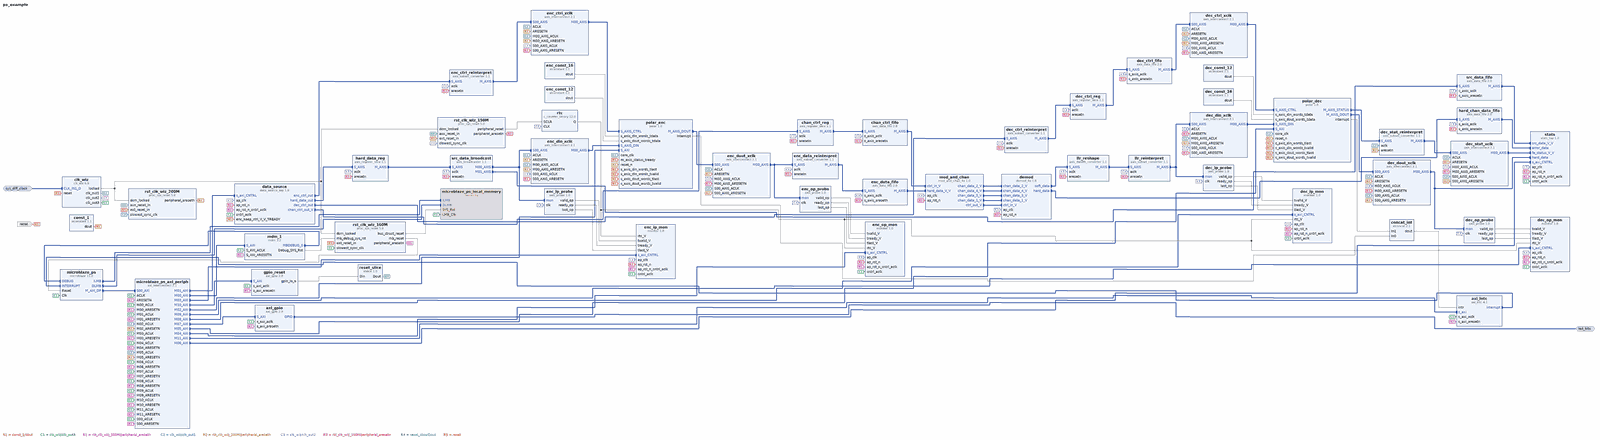
[diagram p0: block diagram of the top level, whole]
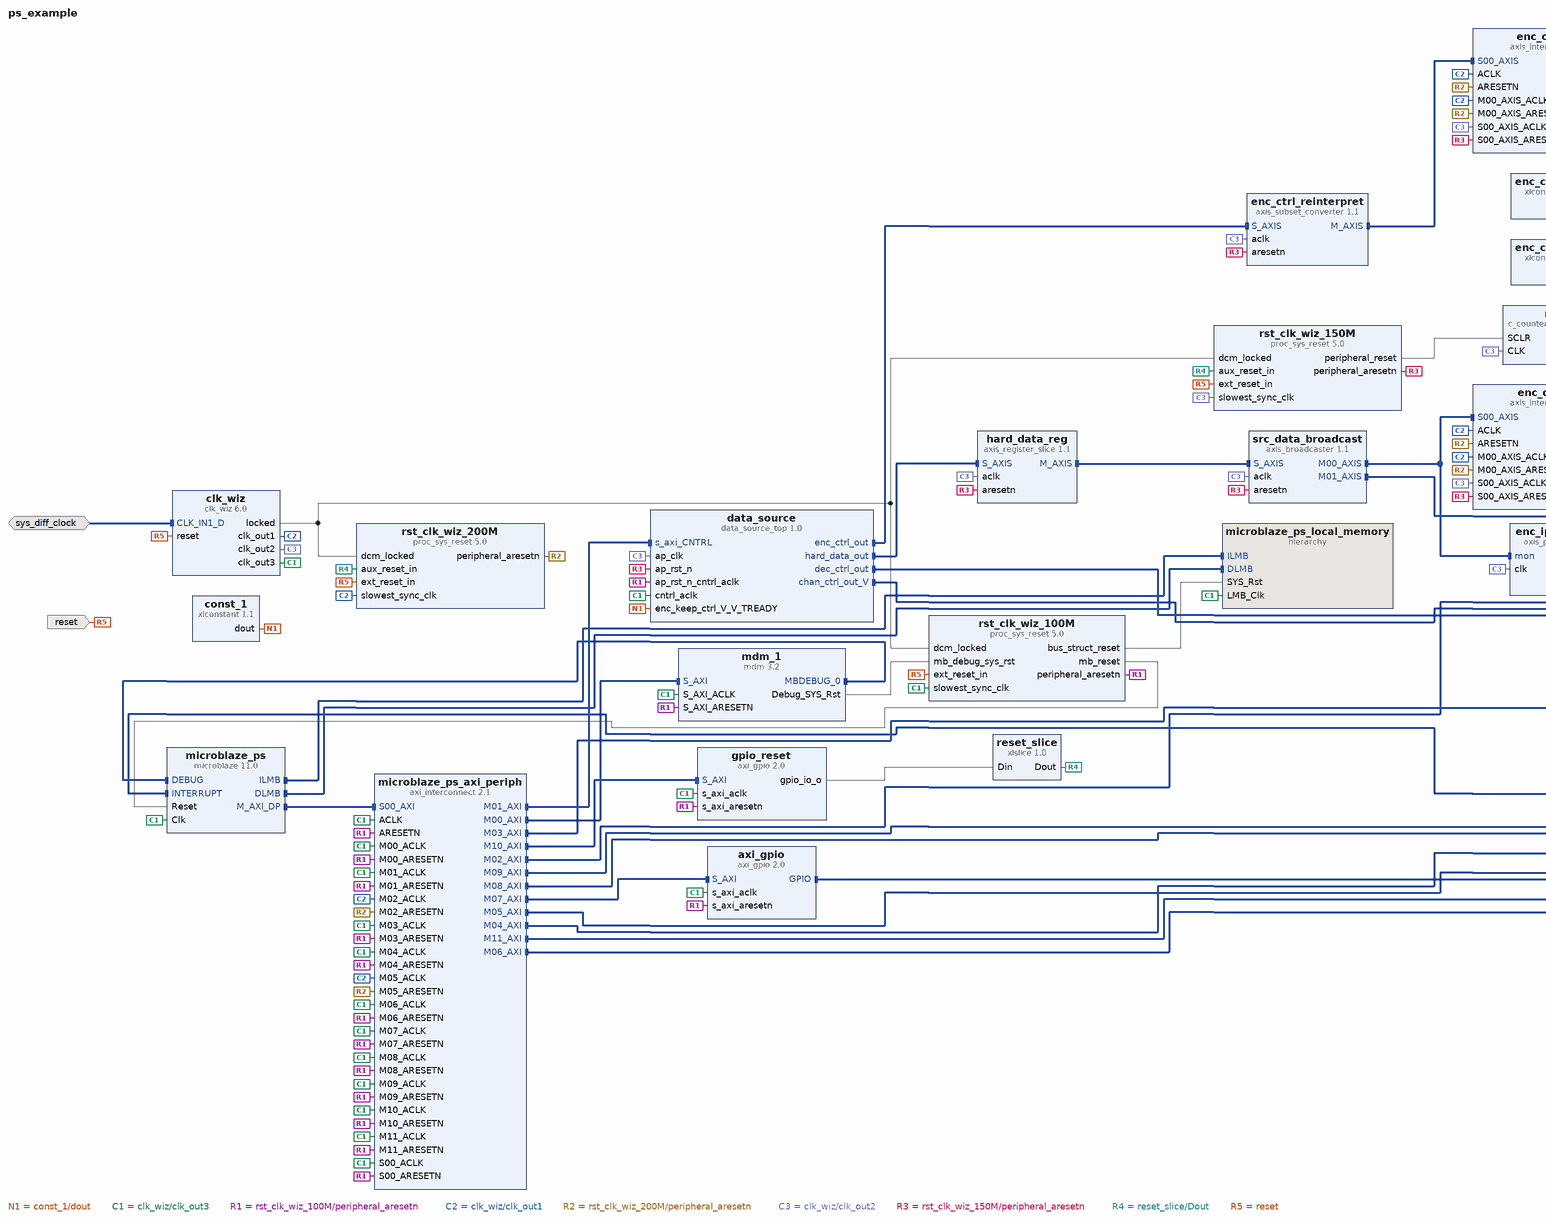
[diagram p1: block diagram of the top level, left part]
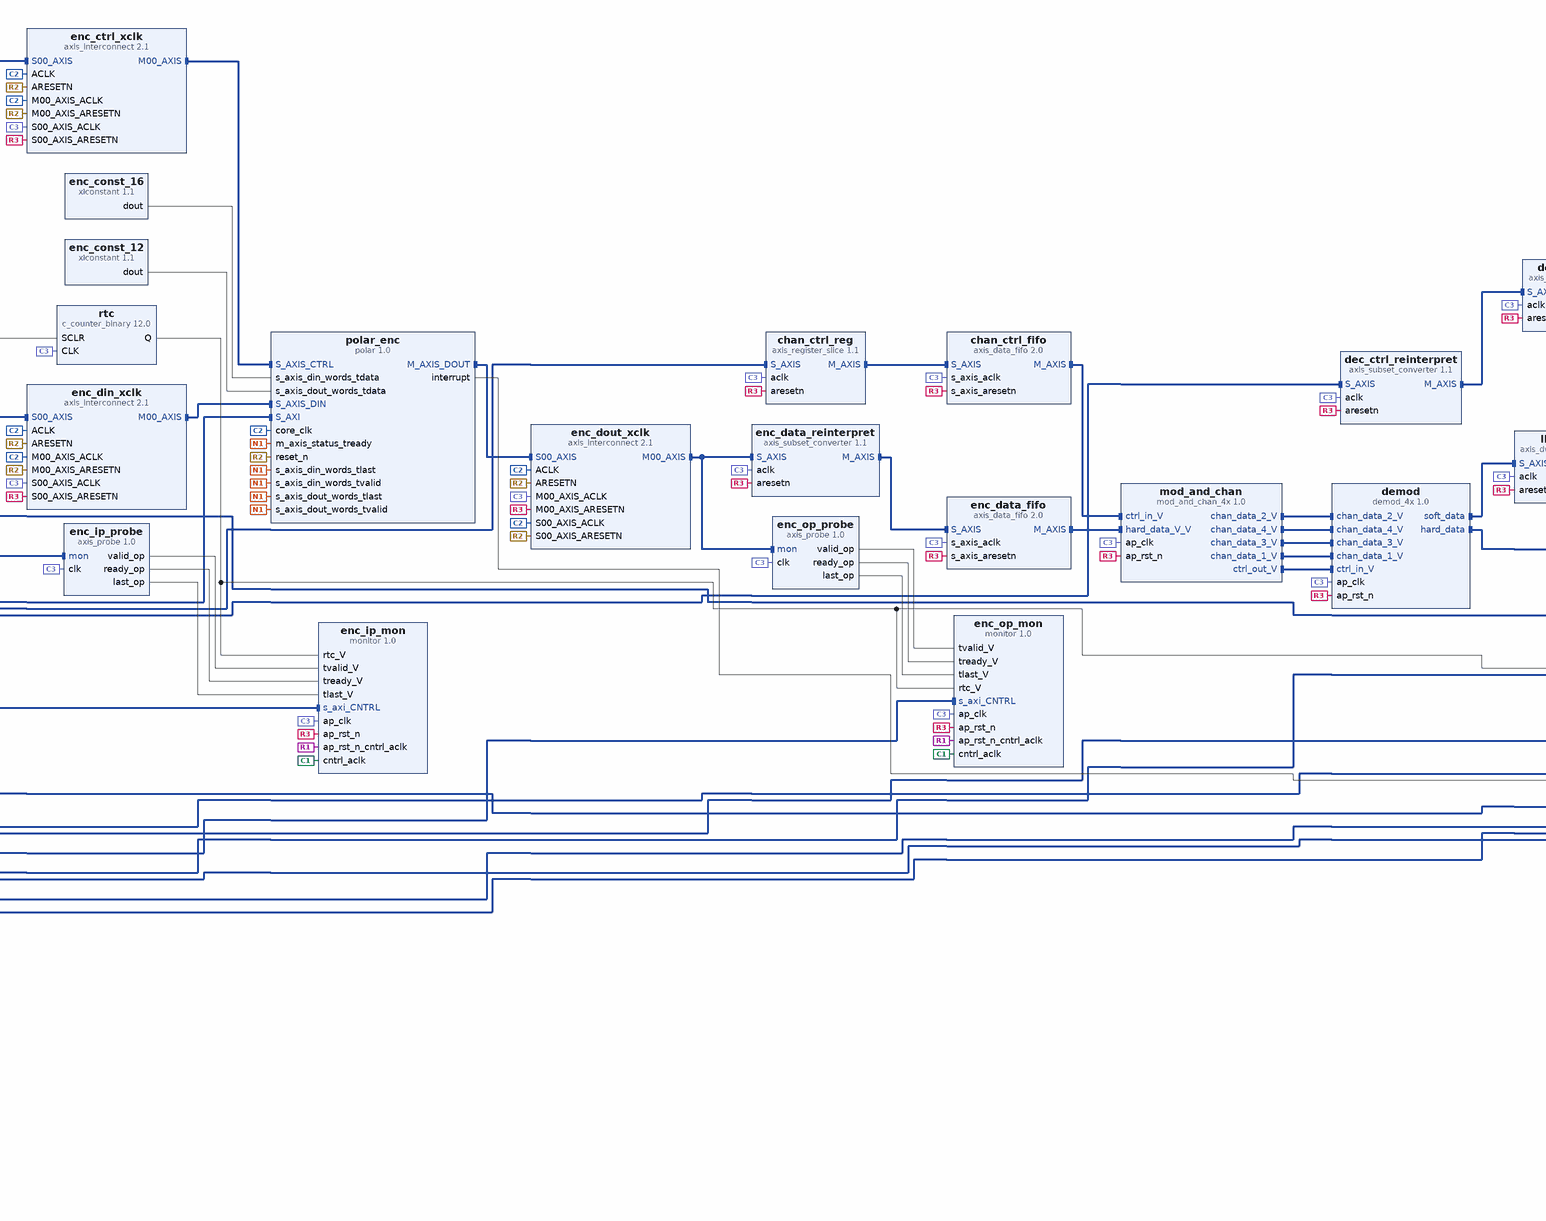
[diagram p2: block diagram of the top level, centre part]
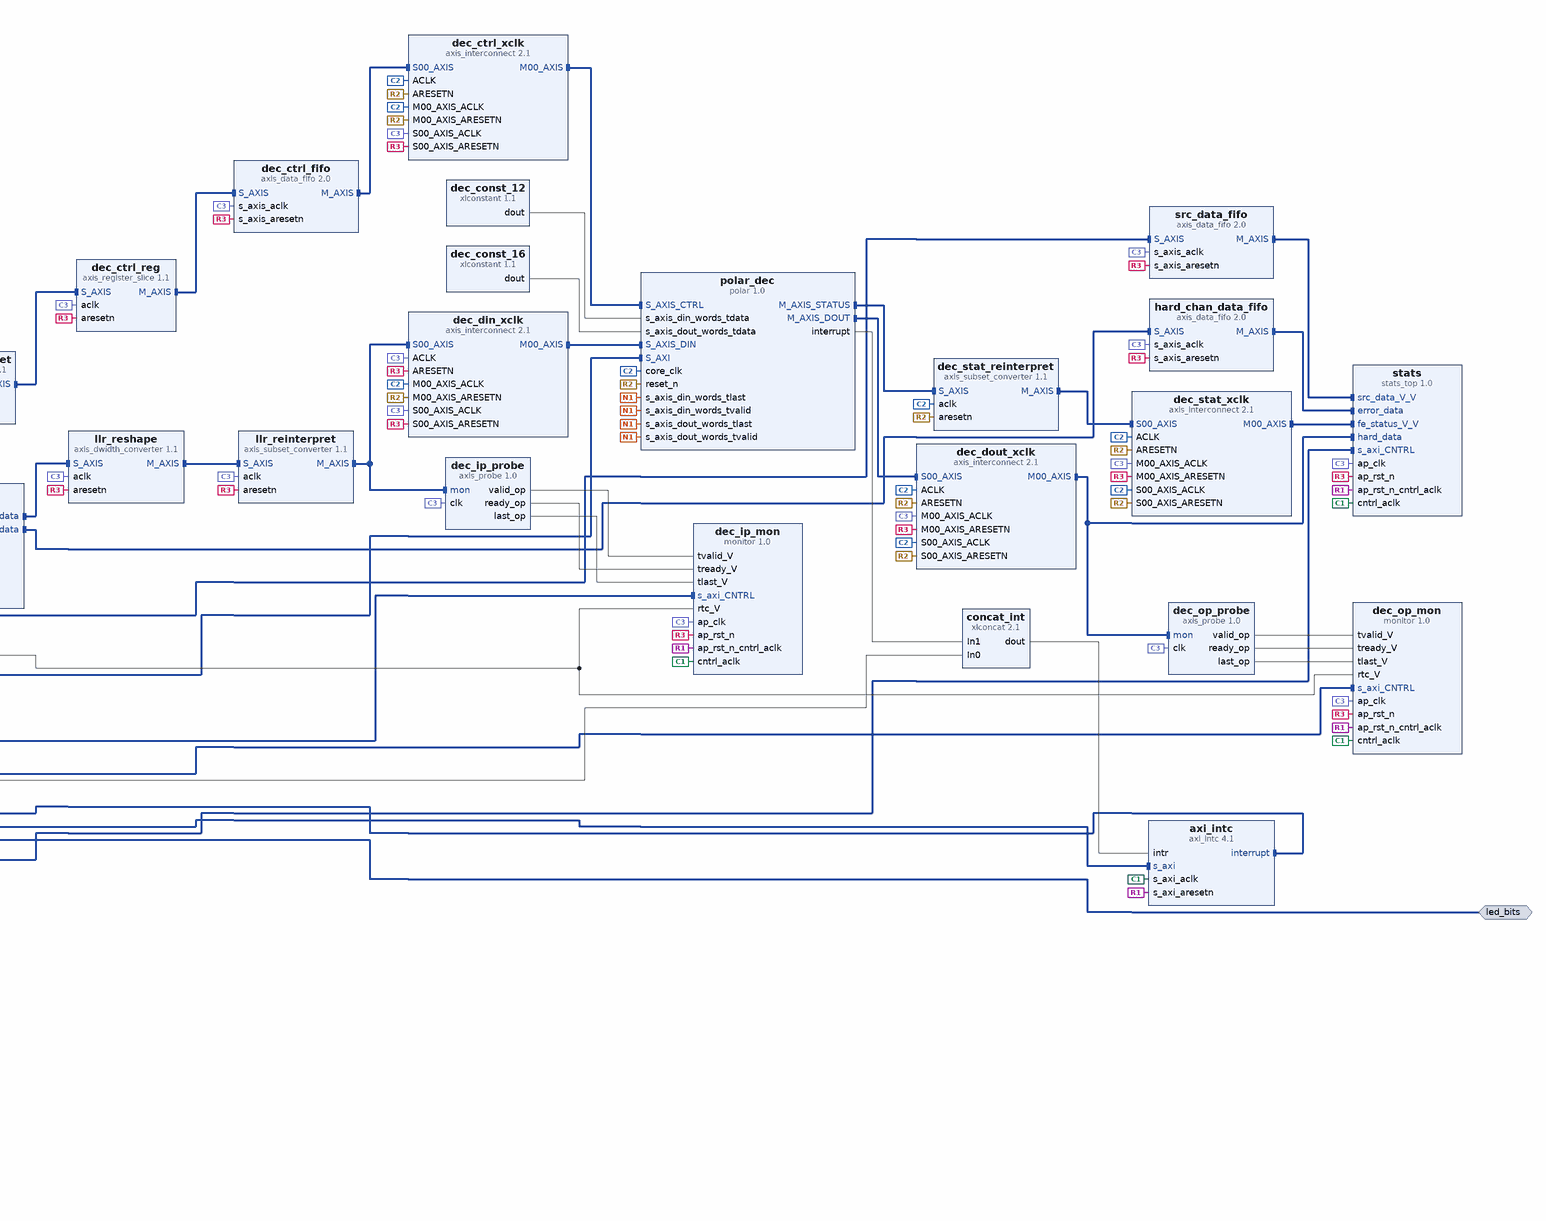
[diagram p3: block diagram of the top level, right part]
# Vivado block design ps_example, xczu9eg-ffvb1156-2-e, Vivado 2018.3
create_bd_design ps_example

create_bd_intf_port -mode Slave -vlnv xilinx.com:interface:diff_clock_rtl:1.0 sys_diff_clock
set_property -dict {CONFIG.FREQ_HZ 100000000} [get_bd_intf_ports sys_diff_clock]
create_bd_intf_port -mode Master -vlnv xilinx.com:interface:gpio_rtl:1.0 led_bits
create_bd_port -dir I -type rst reset
set_property -dict {CONFIG.POLARITY ACTIVE_HIGH} [get_bd_ports reset]

create_bd_cell -type ip -vlnv xilinx.com:ip:clk_wiz:6.0 clk_wiz
set_property -dict [list \
  CONFIG.CLKOUT1_REQUESTED_OUT_FREQ 200 \
  CONFIG.CLKOUT2_REQUESTED_OUT_FREQ 150 \
  CONFIG.CLKOUT2_USED true \
  CONFIG.CLKOUT3_REQUESTED_OUT_FREQ 100 \
  CONFIG.CLKOUT3_USED true \
  CONFIG.PRIM_SOURCE Differential_clock_capable_pin \
] [get_bd_cells clk_wiz]
create_bd_cell -type ip -vlnv xilinx.com:ip:xlconstant:1.1 const_1
set_property -dict {CONFIG.CONST_VAL 1} [get_bd_cells const_1]
create_bd_cell -type ip -vlnv xilinx.com:hls:data_source_top:1.0 data_source
create_bd_cell -type ip -vlnv xilinx.com:ip:axis_register_slice:1.1 chan_ctrl_reg
create_bd_cell -type ip -vlnv xilinx.com:ip:axis_register_slice:1.1 dec_ctrl_reg
create_bd_cell -type ip -vlnv xilinx.com:ip:axis_register_slice:1.1 hard_data_reg
create_bd_cell -type ip -vlnv xilinx.com:ip:axis_subset_converter:1.1 dec_ctrl_reinterpret
set_property -dict {CONFIG.M_TDATA_NUM_BYTES 4} [get_bd_cells dec_ctrl_reinterpret]
create_bd_cell -type ip -vlnv xilinx.com:ip:axis_broadcaster:1.1 src_data_broadcast
create_bd_cell -type ip -vlnv xilinx.com:ip:axis_data_fifo:2.0 src_data_fifo
set_property -dict {CONFIG.FIFO_DEPTH 16384} [get_bd_cells src_data_fifo]
create_bd_cell -type ip -vlnv xilinx.com:ip:axis_data_fifo:2.0 chan_ctrl_fifo
set_property -dict {CONFIG.FIFO_DEPTH 512} [get_bd_cells chan_ctrl_fifo]
create_bd_cell -type ip -vlnv xilinx.com:ip:axis_data_fifo:2.0 dec_ctrl_fifo
set_property -dict {CONFIG.FIFO_DEPTH 512} [get_bd_cells dec_ctrl_fifo]
create_bd_cell -type ip -vlnv xilinx.com:ip:polar:1.0 polar_enc
set_property -dict {CONFIG.Memory_Type Distributed_RAM CONFIG.Operation Encode} [get_bd_cells polar_enc]
create_bd_cell -type ip -vlnv xilinx.com:ip:xlconstant:1.1 enc_const_16
set_property -dict {CONFIG.CONST_VAL 16 CONFIG.CONST_WIDTH 8} [get_bd_cells enc_const_16]
create_bd_cell -type ip -vlnv xilinx.com:ip:xlconstant:1.1 enc_const_12
set_property -dict {CONFIG.CONST_VAL 12 CONFIG.CONST_WIDTH 8} [get_bd_cells enc_const_12]
create_bd_cell -type ip -vlnv xilinx.com:ip:axis_interconnect:2.1 enc_ctrl_xclk
set_property -dict {CONFIG.NUM_MI 1} [get_bd_cells enc_ctrl_xclk]
create_bd_cell -type ip -vlnv xilinx.com:ip:axis_interconnect:2.1 enc_din_xclk
set_property -dict {CONFIG.NUM_MI 1} [get_bd_cells enc_din_xclk]
create_bd_cell -type ip -vlnv xilinx.com:ip:axis_interconnect:2.1 enc_dout_xclk
set_property -dict {CONFIG.NUM_MI 1} [get_bd_cells enc_dout_xclk]
create_bd_cell -type ip -vlnv xilinx.com:ip:axis_subset_converter:1.1 enc_ctrl_reinterpret
set_property -dict {CONFIG.M_TDATA_NUM_BYTES 4} [get_bd_cells enc_ctrl_reinterpret]
create_bd_cell -type ip -vlnv xilinx.com:ip:axis_subset_converter:1.1 enc_data_reinterpret
set_property -dict {CONFIG.M_HAS_TLAST 0 CONFIG.M_TDATA_NUM_BYTES 12 CONFIG.S_HAS_TLAST 1} [get_bd_cells enc_data_reinterpret]
create_bd_cell -type ip -vlnv xilinx.com:ip:axis_data_fifo:2.0 enc_data_fifo
set_property -dict {CONFIG.FIFO_DEPTH 32768} [get_bd_cells enc_data_fifo]
create_bd_cell -type ip -vlnv xilinx.com:hls:mod_and_chan_4x:1.0 mod_and_chan
create_bd_cell -type ip -vlnv xilinx.com:hls:demod_4x:1.0 demod
create_bd_cell -type ip -vlnv xilinx.com:ip:axis_dwidth_converter:1.1 llr_reshape
set_property -dict {CONFIG.M_TDATA_NUM_BYTES 12} [get_bd_cells llr_reshape]
create_bd_cell -type ip -vlnv xilinx.com:ip:axis_subset_converter:1.1 llr_reinterpret
set_property -dict {CONFIG.M_TDATA_NUM_BYTES 16} [get_bd_cells llr_reinterpret]
create_bd_cell -type ip -vlnv xilinx.com:ip:axis_data_fifo:2.0 hard_chan_data_fifo
set_property -dict {CONFIG.FIFO_DEPTH 16384} [get_bd_cells hard_chan_data_fifo]
create_bd_cell -type ip -vlnv xilinx.com:ip:polar:1.0 polar_dec
set_property -dict [list \
  CONFIG.Include_PS_Example_Design true \
  CONFIG.Memory_Type Distributed_RAM \
  CONFIG.Operation Decode \
] [get_bd_cells polar_dec]
create_bd_cell -type ip -vlnv xilinx.com:ip:axis_interconnect:2.1 dec_ctrl_xclk
set_property -dict {CONFIG.NUM_MI 1} [get_bd_cells dec_ctrl_xclk]
create_bd_cell -type ip -vlnv xilinx.com:ip:axis_interconnect:2.1 dec_din_xclk
set_property -dict {CONFIG.NUM_MI 1} [get_bd_cells dec_din_xclk]
create_bd_cell -type ip -vlnv xilinx.com:ip:axis_interconnect:2.1 dec_stat_xclk
set_property -dict {CONFIG.NUM_MI 1} [get_bd_cells dec_stat_xclk]
create_bd_cell -type ip -vlnv xilinx.com:ip:axis_subset_converter:1.1 dec_stat_reinterpret
set_property -dict {CONFIG.M_TDATA_NUM_BYTES 5} [get_bd_cells dec_stat_reinterpret]
create_bd_cell -type ip -vlnv xilinx.com:ip:axis_interconnect:2.1 dec_dout_xclk
set_property -dict {CONFIG.NUM_MI 1} [get_bd_cells dec_dout_xclk]
create_bd_cell -type ip -vlnv xilinx.com:ip:xlconstant:1.1 dec_const_12
set_property -dict {CONFIG.CONST_VAL 12 CONFIG.CONST_WIDTH 8} [get_bd_cells dec_const_12]
create_bd_cell -type ip -vlnv xilinx.com:ip:xlconstant:1.1 dec_const_16
set_property -dict {CONFIG.CONST_VAL 16 CONFIG.CONST_WIDTH 8} [get_bd_cells dec_const_16]
create_bd_cell -type ip -vlnv xilinx.com:hls:stats_top:1.0 stats
create_bd_cell -type ip -vlnv xilinx.com:ip:axi_gpio:2.0 axi_gpio
set_property -dict {CONFIG.C_ALL_OUTPUTS 1 CONFIG.C_GPIO_WIDTH 5} [get_bd_cells axi_gpio]
create_bd_cell -type ip -vlnv xilinx.com:ip:axi_gpio:2.0 gpio_reset
set_property -dict {CONFIG.C_ALL_OUTPUTS 1 CONFIG.C_GPIO_WIDTH 8} [get_bd_cells gpio_reset]
create_bd_cell -type ip -vlnv xilinx.com:ip:xlslice:1.0 reset_slice
set_property -dict {CONFIG.DIN_FROM 0 CONFIG.DIN_TO 0 CONFIG.DIN_WIDTH 8} [get_bd_cells reset_slice]
create_bd_cell -type ip -vlnv xilinx.com:ip:c_counter_binary:12.0 rtc
set_property -dict {CONFIG.Output_Width 32 CONFIG.SCLR true} [get_bd_cells rtc]
create_bd_cell -type ip -vlnv xilinx.com:hls:monitor:1.0 enc_ip_mon
create_bd_cell -type ip -vlnv xilinx.com:user:axis_probe:1.0 enc_ip_probe
create_bd_cell -type ip -vlnv xilinx.com:hls:monitor:1.0 enc_op_mon
create_bd_cell -type ip -vlnv xilinx.com:user:axis_probe:1.0 enc_op_probe
create_bd_cell -type ip -vlnv xilinx.com:hls:monitor:1.0 dec_ip_mon
create_bd_cell -type ip -vlnv xilinx.com:user:axis_probe:1.0 dec_ip_probe
create_bd_cell -type ip -vlnv xilinx.com:hls:monitor:1.0 dec_op_mon
create_bd_cell -type ip -vlnv xilinx.com:user:axis_probe:1.0 dec_op_probe
create_bd_cell -type ip -vlnv xilinx.com:ip:microblaze:11.0 microblaze_ps
set_property -dict {CONFIG.C_DEBUG_ENABLED 1 CONFIG.C_D_AXI 1 CONFIG.C_D_LMB 1 CONFIG.C_I_LMB 1} [get_bd_cells microblaze_ps]
create_bd_cell -type hier microblaze_ps_local_memory
create_bd_cell -type ip -vlnv xilinx.com:ip:axi_interconnect:2.1 microblaze_ps_axi_periph
set_property -dict [list \
  CONFIG.M00_HAS_REGSLICE 4 \
  CONFIG.M01_HAS_REGSLICE 4 \
  CONFIG.M02_HAS_REGSLICE 4 \
  CONFIG.M03_HAS_REGSLICE 4 \
  CONFIG.M04_HAS_REGSLICE 4 \
  CONFIG.M05_HAS_REGSLICE 4 \
  CONFIG.M06_HAS_REGSLICE 4 \
  CONFIG.M07_HAS_REGSLICE 4 \
  CONFIG.M08_HAS_REGSLICE 4 \
  CONFIG.M09_HAS_REGSLICE 4 \
  CONFIG.M10_HAS_REGSLICE 4 \
  CONFIG.M11_HAS_REGSLICE 4 \
  CONFIG.NUM_MI 12 \
] [get_bd_cells microblaze_ps_axi_periph]
create_bd_cell -type ip -vlnv xilinx.com:ip:mdm:3.2 mdm_1
set_property -dict {CONFIG.C_ADDR_SIZE 32 CONFIG.C_M_AXI_ADDR_WIDTH 32 CONFIG.C_USE_UART 1} [get_bd_cells mdm_1]
create_bd_cell -type ip -vlnv xilinx.com:ip:proc_sys_reset:5.0 rst_clk_wiz_100M
create_bd_cell -type ip -vlnv xilinx.com:ip:proc_sys_reset:5.0 rst_clk_wiz_200M
set_property -dict {CONFIG.C_AUX_RESET_HIGH 1} [get_bd_cells rst_clk_wiz_200M]
create_bd_cell -type ip -vlnv xilinx.com:ip:proc_sys_reset:5.0 rst_clk_wiz_150M
set_property -dict {CONFIG.C_AUX_RESET_HIGH 1} [get_bd_cells rst_clk_wiz_150M]
create_bd_cell -type ip -vlnv xilinx.com:ip:axi_intc:4.1 axi_intc
create_bd_cell -type ip -vlnv xilinx.com:ip:xlconcat:2.1 concat_int
set_property -dict {CONFIG.NUM_PORTS 2} [get_bd_cells concat_int]

# ---- hierarchy /microblaze_ps_local_memory ----
current_bd_instance /microblaze_ps_local_memory
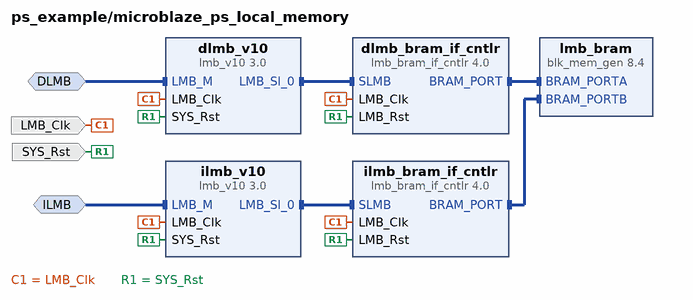
[diagram p4: block diagram inside /microblaze_ps_local_memory]
create_bd_intf_pin -mode MirroredMaster -vlnv xilinx.com:interface:lmb_rtl:1.0 DLMB
create_bd_intf_pin -mode MirroredMaster -vlnv xilinx.com:interface:lmb_rtl:1.0 ILMB
create_bd_pin -dir I -type clk LMB_Clk
create_bd_pin -dir I -type rst SYS_Rst

create_bd_cell -type ip -vlnv xilinx.com:ip:lmb_v10:3.0 dlmb_v10
create_bd_cell -type ip -vlnv xilinx.com:ip:lmb_v10:3.0 ilmb_v10
create_bd_cell -type ip -vlnv xilinx.com:ip:lmb_bram_if_cntlr:4.0 dlmb_bram_if_cntlr
set_property -dict {CONFIG.C_ECC 0} [get_bd_cells dlmb_bram_if_cntlr]
create_bd_cell -type ip -vlnv xilinx.com:ip:lmb_bram_if_cntlr:4.0 ilmb_bram_if_cntlr
set_property -dict {CONFIG.C_ECC 0} [get_bd_cells ilmb_bram_if_cntlr]
create_bd_cell -type ip -vlnv xilinx.com:ip:blk_mem_gen:8.4 lmb_bram
set_property -dict {CONFIG.Memory_Type True_Dual_Port_RAM CONFIG.use_bram_block BRAM_Controller} [get_bd_cells lmb_bram]

# ---- connections ----

current_bd_instance /microblaze_ps_local_memory
connect_bd_intf_net -intf_net microblaze_ps_dlmb_cntlr [get_bd_intf_pins dlmb_bram_if_cntlr/BRAM_PORT] [get_bd_intf_pins lmb_bram/BRAM_PORTA]
connect_bd_intf_net -intf_net microblaze_ps_dlmb_bus [get_bd_intf_pins dlmb_v10/LMB_Sl_0] [get_bd_intf_pins dlmb_bram_if_cntlr/SLMB]
connect_bd_intf_net -intf_net microblaze_ps_ilmb [get_bd_intf_pins ILMB] [get_bd_intf_pins ilmb_v10/LMB_M]
connect_bd_intf_net -intf_net microblaze_ps_ilmb_bus [get_bd_intf_pins ilmb_v10/LMB_Sl_0] [get_bd_intf_pins ilmb_bram_if_cntlr/SLMB]
connect_bd_intf_net -intf_net microblaze_ps_ilmb_cntlr [get_bd_intf_pins ilmb_bram_if_cntlr/BRAM_PORT] [get_bd_intf_pins lmb_bram/BRAM_PORTB]
connect_bd_intf_net -intf_net microblaze_ps_dlmb [get_bd_intf_pins DLMB] [get_bd_intf_pins dlmb_v10/LMB_M]
connect_bd_net -net microblaze_ps_Clk [get_bd_pins LMB_Clk] \
  [get_bd_pins dlmb_v10/LMB_Clk] [get_bd_pins dlmb_bram_if_cntlr/LMB_Clk] [get_bd_pins ilmb_v10/LMB_Clk] \
  [get_bd_pins ilmb_bram_if_cntlr/LMB_Clk]
connect_bd_net [get_bd_pins SYS_Rst] \
  [get_bd_pins dlmb_v10/SYS_Rst] [get_bd_pins dlmb_bram_if_cntlr/LMB_Rst] [get_bd_pins ilmb_v10/SYS_Rst] \
  [get_bd_pins ilmb_bram_if_cntlr/LMB_Rst]
set_property HDL_ATTRIBUTE.BMM_INFO_ADDRESS_SPACE {byte  0x00000000 32 > ps_example microblaze_ps_local_memory/lmb_bram} [get_bd_cells dlmb_bram_if_cntlr]
set_property HDL_ATTRIBUTE.KEEP_HIERARCHY yes [get_bd_cells dlmb_bram_if_cntlr]

current_bd_instance /
connect_bd_intf_net [get_bd_intf_pins microblaze_ps_axi_periph/M03_AXI] [get_bd_intf_pins enc_ip_mon/s_axi_CNTRL]
connect_bd_intf_net -intf_net microblaze_ps_mdm_axi [get_bd_intf_pins microblaze_ps_axi_periph/M00_AXI] [get_bd_intf_pins mdm_1/S_AXI]
connect_bd_intf_net [get_bd_intf_pins dec_dout_xclk/M00_AXIS] [get_bd_intf_pins stats/hard_data]
connect_bd_intf_net [get_bd_intf_pins dec_dout_xclk/M00_AXIS] [get_bd_intf_pins dec_op_probe/mon]
connect_bd_intf_net [get_bd_intf_pins hard_chan_data_fifo/M_AXIS] [get_bd_intf_pins stats/error_data]
connect_bd_intf_net [get_bd_intf_pins dec_stat_xclk/M00_AXIS] [get_bd_intf_pins stats/fe_status_V_V]
connect_bd_intf_net [get_bd_intf_pins dec_din_xclk/M00_AXIS] [get_bd_intf_pins polar_dec/S_AXIS_DIN]
connect_bd_intf_net [get_bd_intf_pins dec_ctrl_fifo/M_AXIS] [get_bd_intf_pins dec_ctrl_xclk/S00_AXIS]
connect_bd_intf_net [get_bd_intf_pins src_data_fifo/M_AXIS] [get_bd_intf_pins stats/src_data_V_V]
connect_bd_intf_net [get_bd_intf_pins dec_ctrl_xclk/M00_AXIS] [get_bd_intf_pins polar_dec/S_AXIS_CTRL]
connect_bd_intf_net [get_bd_intf_pins enc_dout_xclk/M00_AXIS] [get_bd_intf_pins enc_data_reinterpret/S_AXIS]
connect_bd_intf_net [get_bd_intf_pins enc_dout_xclk/M00_AXIS] [get_bd_intf_pins enc_op_probe/mon]
connect_bd_intf_net [get_bd_intf_pins data_source/enc_ctrl_out] [get_bd_intf_pins enc_ctrl_reinterpret/S_AXIS]
connect_bd_intf_net [get_bd_intf_pins polar_dec/M_AXIS_STATUS] [get_bd_intf_pins dec_stat_reinterpret/S_AXIS]
connect_bd_intf_net [get_bd_intf_pins dec_stat_reinterpret/M_AXIS] [get_bd_intf_pins dec_stat_xclk/S00_AXIS]
connect_bd_intf_net [get_bd_intf_pins dec_ctrl_reg/M_AXIS] [get_bd_intf_pins dec_ctrl_fifo/S_AXIS]
connect_bd_intf_net [get_bd_intf_pins chan_ctrl_reg/M_AXIS] [get_bd_intf_pins chan_ctrl_fifo/S_AXIS]
connect_bd_intf_net [get_bd_intf_pins hard_data_reg/M_AXIS] [get_bd_intf_pins src_data_broadcast/S_AXIS]
connect_bd_intf_net [get_bd_intf_pins src_data_broadcast/M01_AXIS] [get_bd_intf_pins src_data_fifo/S_AXIS]
connect_bd_intf_net [get_bd_intf_pins src_data_broadcast/M00_AXIS] [get_bd_intf_pins enc_din_xclk/S00_AXIS]
connect_bd_intf_net [get_bd_intf_pins src_data_broadcast/M00_AXIS] [get_bd_intf_pins enc_ip_probe/mon]
connect_bd_intf_net [get_bd_intf_pins enc_din_xclk/M00_AXIS] [get_bd_intf_pins polar_enc/S_AXIS_DIN]
connect_bd_intf_net [get_bd_intf_pins polar_enc/M_AXIS_DOUT] [get_bd_intf_pins enc_dout_xclk/S00_AXIS]
connect_bd_intf_net [get_bd_intf_pins enc_data_fifo/M_AXIS] [get_bd_intf_pins mod_and_chan/hard_data_V_V]
connect_bd_intf_net [get_bd_intf_pins chan_ctrl_fifo/M_AXIS] [get_bd_intf_pins mod_and_chan/ctrl_in_V]
connect_bd_intf_net [get_bd_intf_pins enc_data_fifo/S_AXIS] [get_bd_intf_pins enc_data_reinterpret/M_AXIS]
connect_bd_intf_net [get_bd_intf_pins enc_ctrl_reinterpret/M_AXIS] [get_bd_intf_pins enc_ctrl_xclk/S00_AXIS]
connect_bd_intf_net [get_bd_intf_pins enc_ctrl_xclk/M00_AXIS] [get_bd_intf_pins polar_enc/S_AXIS_CTRL]
connect_bd_intf_net [get_bd_intf_pins demod/hard_data] [get_bd_intf_pins hard_chan_data_fifo/S_AXIS]
connect_bd_intf_net [get_bd_intf_pins llr_reshape/M_AXIS] [get_bd_intf_pins llr_reinterpret/S_AXIS]
connect_bd_intf_net [get_bd_intf_pins demod/soft_data] [get_bd_intf_pins llr_reshape/S_AXIS]
connect_bd_intf_net [get_bd_intf_pins mod_and_chan/chan_data_2_V] [get_bd_intf_pins demod/chan_data_2_V]
connect_bd_intf_net [get_bd_intf_pins mod_and_chan/chan_data_4_V] [get_bd_intf_pins demod/chan_data_4_V]
connect_bd_intf_net [get_bd_intf_pins mod_and_chan/chan_data_3_V] [get_bd_intf_pins demod/chan_data_3_V]
connect_bd_intf_net [get_bd_intf_pins mod_and_chan/chan_data_1_V] [get_bd_intf_pins demod/chan_data_1_V]
connect_bd_intf_net [get_bd_intf_pins mod_and_chan/ctrl_out_V] [get_bd_intf_pins demod/ctrl_in_V]
connect_bd_intf_net [get_bd_intf_pins dec_ctrl_reinterpret/M_AXIS] [get_bd_intf_pins dec_ctrl_reg/S_AXIS]
connect_bd_intf_net [get_bd_intf_pins data_source/dec_ctrl_out] [get_bd_intf_pins dec_ctrl_reinterpret/S_AXIS]
connect_bd_intf_net [get_bd_intf_pins data_source/chan_ctrl_out_V] [get_bd_intf_pins chan_ctrl_reg/S_AXIS]
connect_bd_intf_net [get_bd_intf_pins data_source/hard_data_out] [get_bd_intf_pins hard_data_reg/S_AXIS]
connect_bd_intf_net [get_bd_intf_pins mdm_1/MBDEBUG_0] [get_bd_intf_pins microblaze_ps/DEBUG]
connect_bd_intf_net [get_bd_intf_pins llr_reinterpret/M_AXIS] [get_bd_intf_pins dec_din_xclk/S00_AXIS]
connect_bd_intf_net [get_bd_intf_pins llr_reinterpret/M_AXIS] [get_bd_intf_pins dec_ip_probe/mon]
connect_bd_intf_net [get_bd_intf_pins polar_dec/M_AXIS_DOUT] [get_bd_intf_pins dec_dout_xclk/S00_AXIS]
connect_bd_intf_net [get_bd_intf_pins microblaze_ps_axi_periph/M09_AXI] [get_bd_intf_pins dec_op_mon/s_axi_CNTRL]
connect_bd_intf_net [get_bd_intf_pins microblaze_ps_axi_periph/M08_AXI] [get_bd_intf_pins dec_ip_mon/s_axi_CNTRL]
connect_bd_intf_net [get_bd_intf_pins microblaze_ps/ILMB] [get_bd_intf_pins microblaze_ps_local_memory/ILMB]
connect_bd_intf_net [get_bd_intf_pins microblaze_ps/DLMB] [get_bd_intf_pins microblaze_ps_local_memory/DLMB]
connect_bd_intf_net [get_bd_intf_pins microblaze_ps_axi_periph/M05_AXI] [get_bd_intf_pins polar_dec/S_AXI]
connect_bd_intf_net [get_bd_intf_pins microblaze_ps_axi_periph/M04_AXI] [get_bd_intf_pins enc_op_mon/s_axi_CNTRL]
connect_bd_intf_net -intf_net diff_clock_rtl_0_1 [get_bd_intf_ports sys_diff_clock] [get_bd_intf_pins clk_wiz/CLK_IN1_D]
connect_bd_intf_net [get_bd_intf_pins microblaze_ps_axi_periph/M11_AXI] [get_bd_intf_pins axi_intc/s_axi]
connect_bd_intf_net [get_bd_intf_pins microblaze_ps_axi_periph/M02_AXI] [get_bd_intf_pins polar_enc/S_AXI]
connect_bd_intf_net [get_bd_intf_pins microblaze_ps_axi_periph/M10_AXI] [get_bd_intf_pins gpio_reset/S_AXI]
connect_bd_intf_net [get_bd_intf_pins axi_intc/interrupt] [get_bd_intf_pins microblaze_ps/INTERRUPT]
connect_bd_intf_net -intf_net microblaze_ps_axi_dp [get_bd_intf_pins microblaze_ps_axi_periph/S00_AXI] [get_bd_intf_pins microblaze_ps/M_AXI_DP]
connect_bd_intf_net [get_bd_intf_ports led_bits] [get_bd_intf_pins axi_gpio/GPIO]
connect_bd_intf_net [get_bd_intf_pins microblaze_ps_axi_periph/M01_AXI] [get_bd_intf_pins data_source/s_axi_CNTRL]
connect_bd_intf_net [get_bd_intf_pins microblaze_ps_axi_periph/M07_AXI] [get_bd_intf_pins axi_gpio/S_AXI]
connect_bd_intf_net [get_bd_intf_pins microblaze_ps_axi_periph/M06_AXI] [get_bd_intf_pins stats/s_axi_CNTRL]
connect_bd_net [get_bd_pins const_1/dout] \
  [get_bd_pins polar_enc/m_axis_status_tready] [get_bd_pins polar_enc/s_axis_din_words_tvalid] \
  [get_bd_pins polar_enc/s_axis_din_words_tlast] [get_bd_pins polar_enc/s_axis_dout_words_tvalid] \
  [get_bd_pins polar_enc/s_axis_dout_words_tlast] [get_bd_pins polar_dec/s_axis_din_words_tvalid] \
  [get_bd_pins polar_dec/s_axis_din_words_tlast] [get_bd_pins polar_dec/s_axis_dout_words_tvalid] \
  [get_bd_pins polar_dec/s_axis_dout_words_tlast] [get_bd_pins data_source/enc_keep_ctrl_V_V_TREADY]
connect_bd_net [get_bd_pins enc_const_16/dout] [get_bd_pins polar_enc/s_axis_din_words_tdata]
connect_bd_net [get_bd_pins enc_const_12/dout] [get_bd_pins polar_enc/s_axis_dout_words_tdata]
connect_bd_net [get_bd_pins dec_const_12/dout] [get_bd_pins polar_dec/s_axis_din_words_tdata]
connect_bd_net [get_bd_pins dec_const_16/dout] [get_bd_pins polar_dec/s_axis_dout_words_tdata]
connect_bd_net [get_bd_pins gpio_reset/gpio_io_o] [get_bd_pins reset_slice/Din]
connect_bd_net [get_bd_pins enc_ip_probe/valid_op] [get_bd_pins enc_ip_mon/tvalid_V]
connect_bd_net [get_bd_pins enc_ip_probe/ready_op] [get_bd_pins enc_ip_mon/tready_V]
connect_bd_net [get_bd_pins enc_ip_probe/last_op] [get_bd_pins enc_ip_mon/tlast_V]
connect_bd_net [get_bd_pins rtc/Q] \
  [get_bd_pins enc_ip_mon/rtc_V] [get_bd_pins enc_op_mon/rtc_V] [get_bd_pins dec_ip_mon/rtc_V] [get_bd_pins dec_op_mon/rtc_V]
connect_bd_net [get_bd_pins enc_op_probe/valid_op] [get_bd_pins enc_op_mon/tvalid_V]
connect_bd_net [get_bd_pins enc_op_probe/ready_op] [get_bd_pins enc_op_mon/tready_V]
connect_bd_net [get_bd_pins enc_op_probe/last_op] [get_bd_pins enc_op_mon/tlast_V]
connect_bd_net [get_bd_pins dec_ip_probe/valid_op] [get_bd_pins dec_ip_mon/tvalid_V]
connect_bd_net [get_bd_pins dec_ip_probe/ready_op] [get_bd_pins dec_ip_mon/tready_V]
connect_bd_net [get_bd_pins dec_ip_probe/last_op] [get_bd_pins dec_ip_mon/tlast_V]
connect_bd_net [get_bd_pins dec_op_probe/valid_op] [get_bd_pins dec_op_mon/tvalid_V]
connect_bd_net [get_bd_pins dec_op_probe/ready_op] [get_bd_pins dec_op_mon/tready_V]
connect_bd_net [get_bd_pins dec_op_probe/last_op] [get_bd_pins dec_op_mon/tlast_V]
connect_bd_net -net microblaze_ps_Clk [get_bd_pins clk_wiz/clk_out3] \
  [get_bd_pins microblaze_ps/Clk] [get_bd_pins microblaze_ps_axi_periph/ACLK] [get_bd_pins microblaze_ps_axi_periph/S00_ACLK] \
  [get_bd_pins microblaze_ps_axi_periph/M00_ACLK] [get_bd_pins microblaze_ps_local_memory/LMB_Clk] \
  [get_bd_pins mdm_1/S_AXI_ACLK] [get_bd_pins rst_clk_wiz_100M/slowest_sync_clk] [get_bd_pins data_source/cntrl_aclk] \
  [get_bd_pins microblaze_ps_axi_periph/M01_ACLK] [get_bd_pins enc_ip_mon/cntrl_aclk] \
  [get_bd_pins microblaze_ps_axi_periph/M03_ACLK] [get_bd_pins enc_op_mon/cntrl_aclk] \
  [get_bd_pins microblaze_ps_axi_periph/M04_ACLK] [get_bd_pins stats/cntrl_aclk] \
  [get_bd_pins microblaze_ps_axi_periph/M06_ACLK] [get_bd_pins axi_gpio/s_axi_aclk] \
  [get_bd_pins microblaze_ps_axi_periph/M07_ACLK] [get_bd_pins dec_ip_mon/cntrl_aclk] \
  [get_bd_pins microblaze_ps_axi_periph/M08_ACLK] [get_bd_pins dec_op_mon/cntrl_aclk] \
  [get_bd_pins microblaze_ps_axi_periph/M09_ACLK] [get_bd_pins gpio_reset/s_axi_aclk] \
  [get_bd_pins microblaze_ps_axi_periph/M10_ACLK] [get_bd_pins axi_intc/s_axi_aclk] \
  [get_bd_pins microblaze_ps_axi_periph/M11_ACLK]
connect_bd_net [get_bd_pins clk_wiz/locked] \
  [get_bd_pins rst_clk_wiz_100M/dcm_locked] [get_bd_pins rst_clk_wiz_200M/dcm_locked] \
  [get_bd_pins rst_clk_wiz_150M/dcm_locked]
connect_bd_net [get_bd_pins rst_clk_wiz_100M/mb_reset] [get_bd_pins microblaze_ps/Reset]
connect_bd_net [get_bd_pins rst_clk_wiz_100M/bus_struct_reset] [get_bd_pins microblaze_ps_local_memory/SYS_Rst]
connect_bd_net [get_bd_pins rst_clk_wiz_100M/peripheral_aresetn] \
  [get_bd_pins microblaze_ps_axi_periph/ARESETN] [get_bd_pins microblaze_ps_axi_periph/S00_ARESETN] \
  [get_bd_pins microblaze_ps_axi_periph/M00_ARESETN] [get_bd_pins mdm_1/S_AXI_ARESETN] \
  [get_bd_pins data_source/ap_rst_n_cntrl_aclk] [get_bd_pins microblaze_ps_axi_periph/M01_ARESETN] \
  [get_bd_pins enc_ip_mon/ap_rst_n_cntrl_aclk] [get_bd_pins microblaze_ps_axi_periph/M03_ARESETN] \
  [get_bd_pins enc_op_mon/ap_rst_n_cntrl_aclk] [get_bd_pins microblaze_ps_axi_periph/M04_ARESETN] \
  [get_bd_pins stats/ap_rst_n_cntrl_aclk] [get_bd_pins microblaze_ps_axi_periph/M06_ARESETN] \
  [get_bd_pins axi_gpio/s_axi_aresetn] [get_bd_pins microblaze_ps_axi_periph/M07_ARESETN] \
  [get_bd_pins dec_ip_mon/ap_rst_n_cntrl_aclk] [get_bd_pins microblaze_ps_axi_periph/M08_ARESETN] \
  [get_bd_pins dec_op_mon/ap_rst_n_cntrl_aclk] [get_bd_pins microblaze_ps_axi_periph/M09_ARESETN] \
  [get_bd_pins gpio_reset/s_axi_aresetn] [get_bd_pins microblaze_ps_axi_periph/M10_ARESETN] \
  [get_bd_pins axi_intc/s_axi_aresetn] [get_bd_pins microblaze_ps_axi_periph/M11_ARESETN]
connect_bd_net [get_bd_pins mdm_1/Debug_SYS_Rst] [get_bd_pins rst_clk_wiz_100M/mb_debug_sys_rst]
connect_bd_net [get_bd_pins clk_wiz/clk_out1] \
  [get_bd_pins polar_enc/core_clk] [get_bd_pins microblaze_ps_axi_periph/M02_ACLK] \
  [get_bd_pins rst_clk_wiz_200M/slowest_sync_clk] [get_bd_pins polar_dec/core_clk] \
  [get_bd_pins microblaze_ps_axi_periph/M05_ACLK] [get_bd_pins enc_ctrl_xclk/ACLK] [get_bd_pins enc_ctrl_xclk/M00_AXIS_ACLK] \
  [get_bd_pins enc_din_xclk/ACLK] [get_bd_pins enc_din_xclk/M00_AXIS_ACLK] [get_bd_pins enc_dout_xclk/ACLK] \
  [get_bd_pins enc_dout_xclk/S00_AXIS_ACLK] [get_bd_pins dec_ctrl_xclk/ACLK] [get_bd_pins dec_ctrl_xclk/M00_AXIS_ACLK] \
  [get_bd_pins dec_din_xclk/M00_AXIS_ACLK] [get_bd_pins dec_stat_xclk/ACLK] [get_bd_pins dec_stat_xclk/S00_AXIS_ACLK] \
  [get_bd_pins dec_stat_reinterpret/aclk] [get_bd_pins dec_dout_xclk/ACLK] [get_bd_pins dec_dout_xclk/S00_AXIS_ACLK]
connect_bd_net [get_bd_pins rst_clk_wiz_200M/peripheral_aresetn] \
  [get_bd_pins microblaze_ps_axi_periph/M02_ARESETN] [get_bd_pins microblaze_ps_axi_periph/M05_ARESETN] \
  [get_bd_pins enc_ctrl_xclk/ARESETN] [get_bd_pins enc_ctrl_xclk/M00_AXIS_ARESETN] [get_bd_pins enc_din_xclk/ARESETN] \
  [get_bd_pins enc_din_xclk/M00_AXIS_ARESETN] [get_bd_pins enc_dout_xclk/ARESETN] \
  [get_bd_pins enc_dout_xclk/S00_AXIS_ARESETN] [get_bd_pins dec_ctrl_xclk/ARESETN] \
  [get_bd_pins dec_ctrl_xclk/M00_AXIS_ARESETN] [get_bd_pins dec_din_xclk/M00_AXIS_ARESETN] \
  [get_bd_pins dec_stat_xclk/ARESETN] [get_bd_pins dec_stat_xclk/S00_AXIS_ARESETN] [get_bd_pins dec_stat_reinterpret/aresetn] \
  [get_bd_pins dec_dout_xclk/ARESETN] [get_bd_pins dec_dout_xclk/S00_AXIS_ARESETN] [get_bd_pins polar_dec/reset_n] \
  [get_bd_pins polar_enc/reset_n]
connect_bd_net [get_bd_pins clk_wiz/clk_out2] \
  [get_bd_pins data_source/ap_clk] [get_bd_pins chan_ctrl_reg/aclk] [get_bd_pins enc_ctrl_reinterpret/aclk] \
  [get_bd_pins dec_ctrl_reinterpret/aclk] [get_bd_pins hard_data_reg/aclk] [get_bd_pins rst_clk_wiz_150M/slowest_sync_clk] \
  [get_bd_pins chan_ctrl_fifo/s_axis_aclk] [get_bd_pins mod_and_chan/ap_clk] [get_bd_pins dec_ctrl_fifo/s_axis_aclk] \
  [get_bd_pins dec_ctrl_reg/aclk] [get_bd_pins dec_ctrl_xclk/S00_AXIS_ACLK] [get_bd_pins enc_ctrl_xclk/S00_AXIS_ACLK] \
  [get_bd_pins src_data_broadcast/aclk] [get_bd_pins enc_din_xclk/S00_AXIS_ACLK] [get_bd_pins src_data_fifo/s_axis_aclk] \
  [get_bd_pins enc_dout_xclk/M00_AXIS_ACLK] [get_bd_pins enc_data_reinterpret/aclk] [get_bd_pins enc_data_fifo/s_axis_aclk] \
  [get_bd_pins demod/ap_clk] [get_bd_pins llr_reshape/aclk] [get_bd_pins hard_chan_data_fifo/s_axis_aclk] \
  [get_bd_pins llr_reinterpret/aclk] [get_bd_pins dec_din_xclk/S00_AXIS_ACLK] [get_bd_pins dec_din_xclk/ACLK] \
  [get_bd_pins dec_stat_xclk/M00_AXIS_ACLK] [get_bd_pins stats/ap_clk] [get_bd_pins dec_dout_xclk/M00_AXIS_ACLK] \
  [get_bd_pins rtc/CLK] [get_bd_pins enc_ip_mon/ap_clk] [get_bd_pins enc_ip_probe/clk] [get_bd_pins enc_op_mon/ap_clk] \
  [get_bd_pins enc_op_probe/clk] [get_bd_pins dec_ip_mon/ap_clk] [get_bd_pins dec_ip_probe/clk] \
  [get_bd_pins dec_op_mon/ap_clk] [get_bd_pins dec_op_probe/clk]
connect_bd_net [get_bd_pins rst_clk_wiz_150M/peripheral_aresetn] \
  [get_bd_pins data_source/ap_rst_n] [get_bd_pins chan_ctrl_reg/aresetn] [get_bd_pins enc_ctrl_reinterpret/aresetn] \
  [get_bd_pins dec_ctrl_reinterpret/aresetn] [get_bd_pins hard_data_reg/aresetn] [get_bd_pins chan_ctrl_fifo/s_axis_aresetn] \
  [get_bd_pins mod_and_chan/ap_rst_n] [get_bd_pins dec_ctrl_fifo/s_axis_aresetn] [get_bd_pins dec_ctrl_reg/aresetn] \
  [get_bd_pins dec_ctrl_xclk/S00_AXIS_ARESETN] [get_bd_pins enc_ctrl_xclk/S00_AXIS_ARESETN] \
  [get_bd_pins src_data_broadcast/aresetn] [get_bd_pins enc_din_xclk/S00_AXIS_ARESETN] \
  [get_bd_pins src_data_fifo/s_axis_aresetn] [get_bd_pins enc_dout_xclk/M00_AXIS_ARESETN] \
  [get_bd_pins enc_data_reinterpret/aresetn] [get_bd_pins enc_data_fifo/s_axis_aresetn] [get_bd_pins demod/ap_rst_n] \
  [get_bd_pins llr_reshape/aresetn] [get_bd_pins hard_chan_data_fifo/s_axis_aresetn] [get_bd_pins llr_reinterpret/aresetn] \
  [get_bd_pins dec_din_xclk/S00_AXIS_ARESETN] [get_bd_pins dec_din_xclk/ARESETN] [get_bd_pins dec_stat_xclk/M00_AXIS_ARESETN] \
  [get_bd_pins stats/ap_rst_n] [get_bd_pins dec_dout_xclk/M00_AXIS_ARESETN] [get_bd_pins enc_ip_mon/ap_rst_n] \
  [get_bd_pins enc_op_mon/ap_rst_n] [get_bd_pins dec_ip_mon/ap_rst_n] [get_bd_pins dec_op_mon/ap_rst_n]
connect_bd_net [get_bd_pins rst_clk_wiz_150M/peripheral_reset] [get_bd_pins rtc/SCLR]
connect_bd_net [get_bd_pins reset_slice/Dout] [get_bd_pins rst_clk_wiz_150M/aux_reset_in] [get_bd_pins rst_clk_wiz_200M/aux_reset_in]
connect_bd_net [get_bd_pins polar_enc/interrupt] [get_bd_pins concat_int/In0]
connect_bd_net [get_bd_pins polar_dec/interrupt] [get_bd_pins concat_int/In1]
connect_bd_net [get_bd_pins concat_int/dout] [get_bd_pins axi_intc/intr]
connect_bd_net -net reset_rtl_0_1 [get_bd_ports reset] \
  [get_bd_pins clk_wiz/reset] [get_bd_pins rst_clk_wiz_200M/ext_reset_in] [get_bd_pins rst_clk_wiz_150M/ext_reset_in] \
  [get_bd_pins rst_clk_wiz_100M/ext_reset_in]
set_property HDL_ATTRIBUTE.BMM_INFO_PROCESSOR {microblaze-le > ps_example microblaze_ps_local_memory/dlmb_bram_if_cntlr} [get_bd_cells microblaze_ps]
set_property HDL_ATTRIBUTE.KEEP_HIERARCHY yes [get_bd_cells microblaze_ps]

# ---- address map ----
assign_bd_address -offset 0x00000000 -range 1M -target_address_space [get_bd_addr_spaces microblaze_ps/Data] [get_bd_addr_segs microblaze_ps_local_memory/dlmb_bram_if_cntlr/SLMB/Mem]
assign_bd_address -offset 0x40000000 -range 64K -target_address_space [get_bd_addr_spaces microblaze_ps/Data] [get_bd_addr_segs axi_gpio/S_AXI/Reg]
assign_bd_address -offset 0x40010000 -range 64K -target_address_space [get_bd_addr_spaces microblaze_ps/Data] [get_bd_addr_segs gpio_reset/S_AXI/Reg]
assign_bd_address -offset 0x41200000 -range 64K -target_address_space [get_bd_addr_spaces microblaze_ps/Data] [get_bd_addr_segs axi_intc/S_AXI/Reg]
assign_bd_address -offset 0x41400000 -range 4K -target_address_space [get_bd_addr_spaces microblaze_ps/Data] [get_bd_addr_segs mdm_1/S_AXI/Reg]
assign_bd_address -offset 0x44A00000 -range 64K -target_address_space [get_bd_addr_spaces microblaze_ps/Data] [get_bd_addr_segs data_source/s_axi_CNTRL/Reg]
assign_bd_address -offset 0x44A10000 -range 64K -target_address_space [get_bd_addr_spaces microblaze_ps/Data] [get_bd_addr_segs enc_ip_mon/s_axi_CNTRL/Reg]
assign_bd_address -offset 0x44A20000 -range 64K -target_address_space [get_bd_addr_spaces microblaze_ps/Data] [get_bd_addr_segs enc_op_mon/s_axi_CNTRL/Reg]
assign_bd_address -offset 0x44A30000 -range 64K -target_address_space [get_bd_addr_spaces microblaze_ps/Data] [get_bd_addr_segs stats/s_axi_CNTRL/Reg]
assign_bd_address -offset 0x44A40000 -range 256K -target_address_space [get_bd_addr_spaces microblaze_ps/Data] [get_bd_addr_segs polar_enc/S_AXI/PARAMS]
assign_bd_address -offset 0x44A80000 -range 256K -target_address_space [get_bd_addr_spaces microblaze_ps/Data] [get_bd_addr_segs polar_dec/S_AXI/PARAMS]
assign_bd_address -offset 0x44AC0000 -range 64K -target_address_space [get_bd_addr_spaces microblaze_ps/Data] [get_bd_addr_segs dec_ip_mon/s_axi_CNTRL/Reg]
assign_bd_address -offset 0x44AD0000 -range 64K -target_address_space [get_bd_addr_spaces microblaze_ps/Data] [get_bd_addr_segs dec_op_mon/s_axi_CNTRL/Reg]
assign_bd_address -offset 0x00000000 -range 1M -target_address_space [get_bd_addr_spaces microblaze_ps/Instruction] [get_bd_addr_segs microblaze_ps_local_memory/ilmb_bram_if_cntlr/SLMB/Mem]

validate_bd_design
save_bd_design
